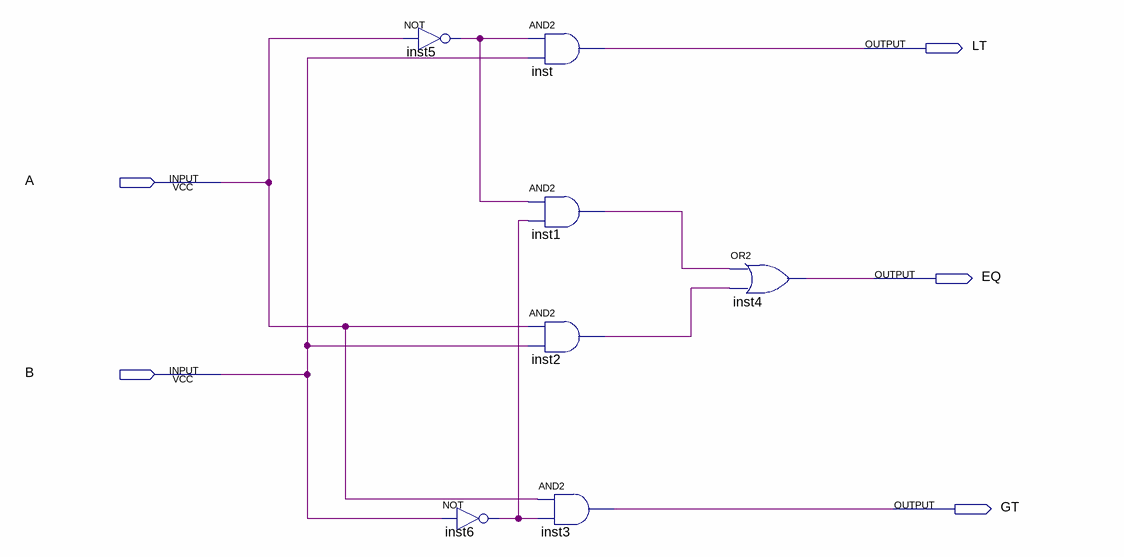
[diagram p0: schematic sheet]
// Quartus schematic COMPARE.bdf as structural Verilog: 7 symbols, 5 pins
module COMPARE (
  input  A,
  input  B,
  output LT,
  output EQ,
  output GT
);

  wire inst1_out, inst2_out, inst5_out, inst6_out;

  not inst5 (inst5_out, A);
  not inst6 (inst6_out, B);
  and inst (LT, inst5_out, B);
  and inst1 (inst1_out, inst5_out, inst6_out);
  and inst2 (inst2_out, A, B);
  and inst3 (GT, A, inst6_out);
  or inst4 (EQ, inst1_out, inst2_out);
endmodule
